# Altium schematic sheet io.SchDoc
size A
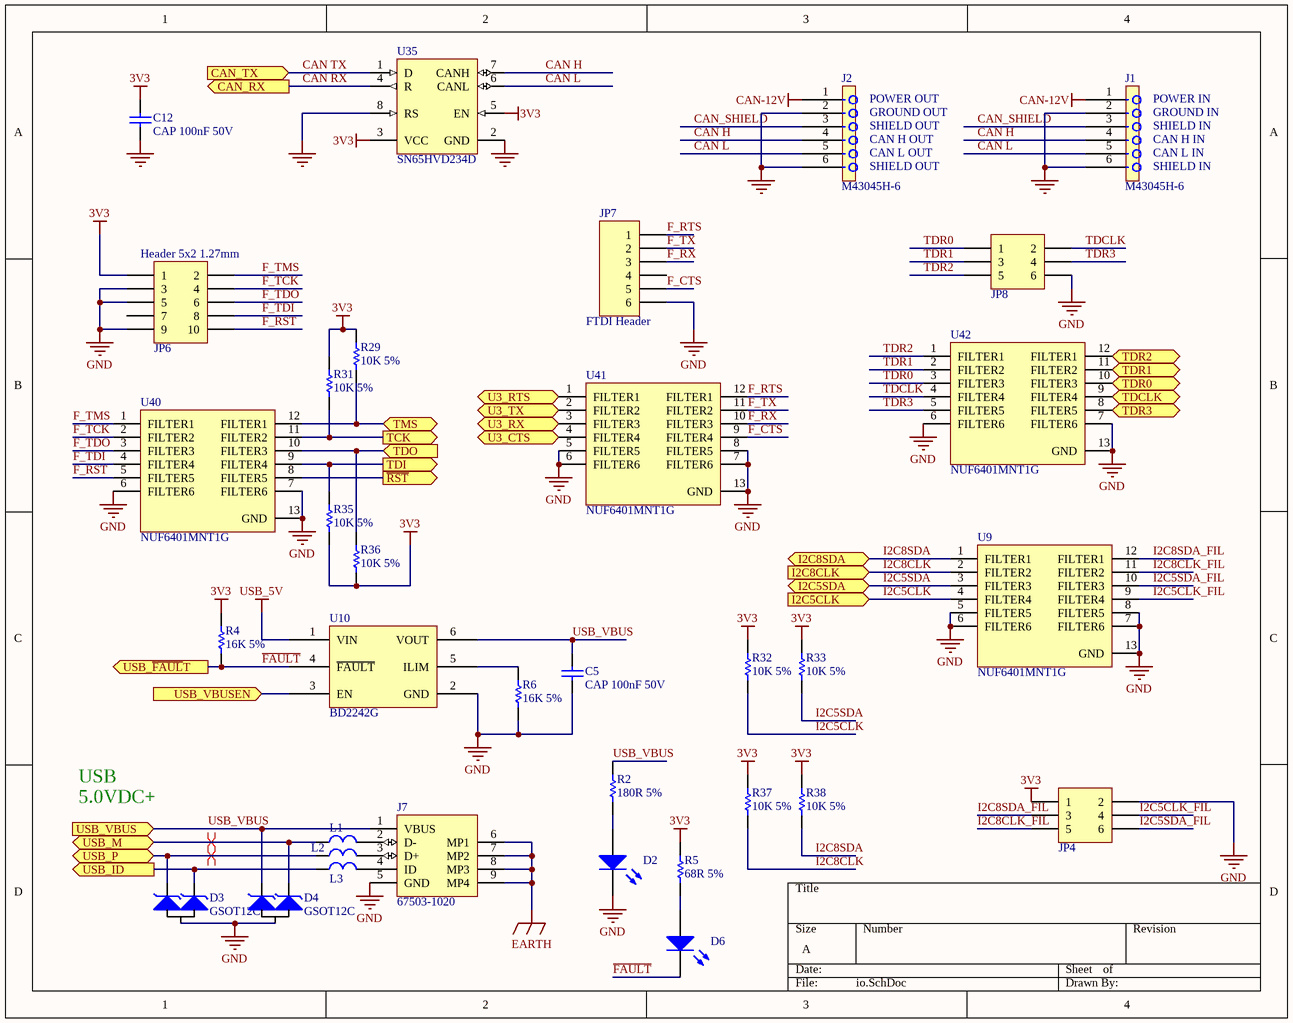
[diagram p0: io.SchDoc]

## Parts
C5  CAP 100nF 50V  [CAPC0603(1608)100_M]
C12  CAP 100nF 50V  [CAPC0603(1608)100_M]
D2  LED  [LED-0603]  (value not drawn)
D3  GSOT12C  [SOT-23 - ESD]
D4  GSOT12C  [SOT-23 - ESD]
D6  LED  [LED-0603]  (value not drawn)
J1  M43045H-6  [M43045H-6]
J2  M43045H-6  [M43045H-6]
J7  67503-1020  [MOLX-67503-1020_V]
JP4  Header 3x2 2.54mm  [2X3]  (value not drawn)
JP6  Header 5x2 1.27mm  [SOP10]
JP7  FTDI Header  [1X6]
JP8  Header 3x2 2.54mm  [2X3]  (value not drawn)
L1  MPZ1608S102A  [0603]  (value not drawn)
L2  MPZ1608S102A  [0603]  (value not drawn)
L3  MPZ1608S102A  [0603]  (value not drawn)
R2  180R 5%  [RESC0603(1608)_L]
R4  16K 5%  [RESC0603(1608)_L]
R5  68R 5%  [RESC0603(1608)_M]
R6  16K 5%  [RESC0603(1608)_L]
R29  10K 5%  [RESC0603(1608)_N]
R31  10K 5%  [RESC0603(1608)_N]
R32  10K 5%  [RESC0603(1608)_N]
R33  10K 5%  [RESC0603(1608)_N]
R35  10K 5%  [RESC0603(1608)_N]
R36  10K 5%  [RESC0603(1608)_N]
R37  10K 5%  [RESC0603(1608)_N]
R38  10K 5%  [RESC0603(1608)_N]
U9  NUF6401MNT1G  [ONSC-DFN-12-506AD-01_V]
U10  BD2242G  [SOT23-6]
U35  SN65HVD234D  [D8_M]
U40  NUF6401MNT1G  [ONSC-DFN-12-506AD-01_V]
U41  NUF6401MNT1G  [ONSC-DFN-12-506AD-01_V]
U42  NUF6401MNT1G  [ONSC-DFN-12-506AD-01_V]

## Ports
CAN_RX (out), CAN_TX (in), I2C5CLK (in), I2C5SDA (bidir), I2C8CLK (in), I2C8SDA (bidir), TCK (out), TDCLK (bidir), TDI (out), TDO (in), TDR0 (bidir), TDR1 (bidir), TDR2 (bidir), TDR3 (bidir), TMS (bidir), U3_CTS (in), U3_RTS (out), U3_RX (out), U3_TX (in), USB_ID (out), USB_M (bidir), USB_P (bidir), USB_VBUS (in), USB_VBUSEN (in), USB_~{FAUL}T (out), ~{RST} (out)

## Nets
3V3: C12.2 JP4.1 JP6.1 R4.2 R5.2 R29.2 R31.2 R32.2 R33.2 R35.1 R36.1 R37.2 R38.2 U35.3(VCC) U35.5(EN)
CAN-12V: J1.1 J2.1
EARTH: J7.6(MP1) J7.7(MP2) J7.8(MP3) J7.9(MP4)
GND: C5.1 C12.1 D2.2(K) D3.3(A) D4.3(A) J1.2 J1.6 J2.2 J2.6 J7.5(GND) JP4.2 JP6.3 JP6.5 JP6.9 JP7.6 JP8.6 R6.1 U9.5(FILTER5) U9.6(FILTER6) U9.7(FILTER6) U9.8(FILTER5) U9.13(GND) U10.2(GND) U35.2(GND) U35.8(RS) U40.6(FILTER6) U40.7(FILTER6) U40.13(GND) U41.5(FILTER5) U41.6(FILTER6) U41.7(FILTER6) U41.8(FILTER5) U41.13(GND) U42.6(FILTER6) U42.7(FILTER6) U42.13(GND)
USB_5V: U10.1(VIN)
CAN H: J1.4 J2.4 U35.7(CANH)
CAN L: J1.5 J2.5 U35.6(CANL)
CAN RX: U35.4(R) ; port CAN_RX
CAN TX: U35.1(D) ; port CAN_TX
CAN_SHIELD: J1.3 J2.3
~{FAULT}: D6.2(K) R4.1 U10.4(~{FAULT}) ; port USB_~{FAUL}T
F_CTS: JP7.5 U41.9(FILTER4)
F_~{RST}: JP6.10 U40.5(FILTER5)
F_RTS: JP7.1 U41.12(FILTER1)
F_RX: JP7.3 U41.10(FILTER3)
F_TCK: JP6.4 U40.2(FILTER2)
F_TDI: JP6.8 U40.4(FILTER4)
F_TDO: JP6.6 U40.3(FILTER3)
F_TMS: JP6.2 U40.1(FILTER1)
F_TX: JP7.2 U41.11(FILTER2)
I2C5CLK: R32.1 U9.4(FILTER4) ; port I2C5CLK
I2C5CLK_FIL: JP4.4 U9.9(FILTER4)
I2C5SDA: R33.1 U9.3(FILTER3) ; port I2C5SDA
I2C5SDA_FIL: JP4.6 U9.10(FILTER3)
I2C8CLK: R37.1 U9.2(FILTER2) ; port I2C8CLK
I2C8CLK_FIL: JP4.5 U9.11(FILTER2)
I2C8SDA: R38.1 U9.1(FILTER1) ; port I2C8SDA
I2C8SDA_FIL: JP4.3 U9.12(FILTER1)
~{RST}: U40.8(FILTER5) ; port ~{RST}
TCK: R31.1 U40.11(FILTER2) ; port TCK
TDCLK: JP8.2 U42.4(FILTER4)
TDCLK: U42.9(FILTER4) ; port TDCLK  [a separate net that carries the same name]
TDI: R35.2 U40.9(FILTER4) ; port TDI
TDO: R36.2 U40.10(FILTER3) ; port TDO
TDR0: JP8.1 U42.3(FILTER3)
TDR0: U42.10(FILTER3) ; port TDR0  [a separate net that carries the same name]
TDR1: JP8.3 U42.2(FILTER2)
TDR1: U42.11(FILTER2) ; port TDR1  [a separate net that carries the same name]
TDR2: JP8.5 U42.1(FILTER1)
TDR2: U42.12(FILTER1) ; port TDR2  [a separate net that carries the same name]
TDR3: JP8.4 U42.5(FILTER5)
TDR3: U42.8(FILTER5) ; port TDR3  [a separate net that carries the same name]
TMS: R29.1 U40.12(FILTER1) ; port TMS
U3_CTS: U41.4(FILTER4) ; port U3_CTS
U3_RTS: U41.1(FILTER1) ; port U3_RTS
U3_RX: U41.3(FILTER3) ; port U3_RX
U3_TX: U41.2(FILTER2) ; port U3_TX
USB_ID: D3.2(K2) L3.1 ; port USB_ID
USB_M: D4.2(K2) L1.1 ; port USB_M
USB_P: D3.1(K1) L2.1 ; port USB_P
USB_VBUS: C5.2 D4.1(K1) J7.1(VBUS) R2.2 U10.6(VOUT) ; port USB_VBUS
USB_VBUSEN: U10.3(EN) ; port USB_VBUSEN
NetD2_1: D2.1(A) R2.1
NetD6_1: D6.1(A) R5.1
NetJ7_2: J7.2(D-) L1.2
NetJ7_3: J7.3(D+) L2.2
NetJ7_4: J7.4(ID) L3.2
NetR6_2: R6.2 U10.5(ILIM)

Not connected (* = marked no-connect by the designer): JP6 7; JP7 4

## Layout directives
differential pair: USB_M, USB_P

## Notes on the sheet
- (near J2) POWER OUT
- (near J1) POWER IN
- (near J2) GROUND OUT
- (near J2) SHIELD OUT
- (near J2) CAN H OUT
- (near J2) CAN L OUT
- (near J1) GROUND IN
- (near J1) SHIELD IN
- (near J1) CAN H IN
- (near J1) CAN L IN
- USB
- 5.0VDC+

## Library data of the parts
C5 C12 = CMP-1035-00010-1: CAP 100nF 50V Â±0.1pF 0603 (1608 Metric) Thickness 1mm SMD; Case-Metric: 1608; Case-EIA: 0603; Tolerance: Â±0.1pF; Technology: SMT; Value: 100nF; Max Thickness: 1 mm; Rated Voltage: 50 V
D2 D6 = LED: Typical RED, GREEN, YELLOW, AMBER GaAs LED; Published: 8-Jun-2000; LatestRevisionDate: 17-Jul-2002; LatestRevisionNote: Re-released for DXP Platform.; PackageVersion: Feb-2002; PackageReference: 3.2X1.6X1.1; Publisher: Altium Limited; PackageDescription: SM LED; 2 Flat Leads; Supplier 1: Digi-Key; Supplier 2: Mouser; Supplier Part Number 1: 475-1409-1-ND; Supplier Part Number 2: 720-LGQ971-KN-1
D3 D4 = 2749: DIO GSOT12C ESD 2LINE 12V SOT23; MPN: GSOT12C-E3-08; COST1K: 0.11250; COST10: 0.3750; COST100: 0.25000; MAN: Vishay Semiconductor Diodes Division; SPN: GSOT12C-E3-08DKR-ND; Supplier: Digi-Key
J1 J2 = CON6: CID: 317
J7 = CMP-0411-00002-1: USB, MINI, SMD, RA KME04-USBMU03A01; Manufacturer: Molex; ComponentLink1URL: http://www.molex.com/; PartNumber: 67503-1020; Mounting Technology: Surface Mount; ComponentLink1Description: Manufacturer URL; Terminal Pitch: 0.8 mm; DatasheetVersion: Rev F, 06/2009; ComponentLink2Description: Datasheet; PackageDescription: Mini USB Connector, SMT, Righer Angle; ComponentLink2URL: http://www.molex.com/pdm_docs/sd/675031020_sd.pdf; PackageReference: 67503-1020
JP4 JP8 = Header 3x2: Header, 6-Pin; Supplier 1: Digi-Key; Supplier 2: Mouser; Supplier Part Number 1: 952-1788-ND; Supplier Part Number 2: 855-M20-9980446
JP6 = Header 5x2: Program; Supplier 1: Digi-Key; Supplier Part Number 1: 1175-1735-ND
JP7 = Header 6: Header, 6-Pin; Supplier 1: Digi-Key; Supplier 2: Mouser; Supplier Part Number 1: 952-2270-ND; Supplier Part Number 2: 538-90120-1086
L1-L3 = 2982: IND FERRITE CHIP BEAD 1000 OHM @ 100MHz 800mA 0603; COST1K: 0.02717; COST10: 0.0790; COST100: 0.04720; MAN: TDK Corporation; SPN: 445-8694-6-ND; MPN: MPZ1608S102A; Supplier: Digi-Key
R2 = CMP-1012-00056-1: 180R 0.1W 5% 0603 (1608 Metric)  SMD; Value: 180.00 Ohm; Case-EIA: 0603; Case-Metric: 1608; Power: 0.1 W; Technology: SMT; Tolerance: 5 %
R4 R6 = CMP-1012-00103-1: 16K 0.1W 5% 0603 (1608 Metric)  SMD; Value: 16000.00 Ohm; Case-EIA: 0603; Case-Metric: 1608; Tolerance: 5 %; Technology: SMT; Power: 0.1 W
R5 = CMP-1012-00046-1: 68R 0.1W 5% 0603 (1608 Metric)  SMD; Case-EIA: 0603; Value: 68.00 Ohm; Case-Metric: 1608; Power: 0.1 W; Technology: SMT; Tolerance: 5 %
R29 R31-R33 R35-R38 = CMP-1012-00098-1: 10K 0.1W 5% 0603 (1608 Metric)  SMD; Case-EIA: 0603; Value: 10000.00 Ohm; Case-Metric: 1608; Technology: SMT; Tolerance: 5 %; Power: 0.1 W
U9 U40-U42 = CMP-1066-00005-1: 6-Channel EMI Filter with Integrated ESD Protection, -40 to 105 degC, 12-Pin DFN, Pb-Free, Tape and Reel; Manufacturer: On Semiconductor; Number of Lines: 6; VRWM Max (V): 5; V(BR) Typ (V): 7; PackageReference: DFN-12-506AD-01; PartNumber: NUF6401MNT1G; ComponentLink3Description: Package Specification; RoHS: Pb-Free; Mounting Technology: Surface Mount; ComponentLink2Description: Datasheet; ComponentLink1Description: Manufacturer URL; PackageDescription: 12-Pin Small Outline No-Lead, Body 3 x 1.35 mm, Pitch 0.5 mm; Packing: Tape and Reel; DatasheetVersion: Rev. 2; ComponentLink2URL: http://www.onsemi.com/pub_link/Collateral/NUF6401-D.PDF; PackageVersion: Rev. J, 07/2008; ComponentLink3URL: http://www.onsemi.com/pub_link/Collateral/506AD.PDF; ComponentLink1URL: http://www.onsemi.com/
  U40-U42: Supplier 1: Digi-Key; Supplier Part Number 1: NUF6401MNT1GOSCT-ND
U10 = RT9728A: BD2242G-GTR; Supplier 1: Digi-Key; Supplier Part Number 1: BD2242G-GCT-ND
U35 = CMP-0315-00083-1: 3.3V CAN Transceiver with Sleep Mode, 6 mA, -40 to 125 degC, 8-pin SOIC (D), Green (RoHS & no Sb/Br); Manufacturer: Texas Instruments; Receivers Per Package: 1; ICC(Max)(mA): 6; Bus Fault Voltage(V): +/-30; Supply Voltage(s)(V): 3.3; Rating: Catalog; Transient Pulse Protection(V): -100 to 100; PartNumber: SN65HVD234D; SubFamily: CAN; DatasheetVersion: SLLS557F; Mounting Technology: Surface Mount; Eco-Plan: Green (RoHS & no Sb/Br); PackageVersion: revM, Jun-2011; PackageReference: D8; ComponentLink1Description: Datasheet; Drivers Per Package: 1; Isolated: No; ComponentLink1URL: http://www.ti.com/general/docs/lit/getliterature.tsp?genericPartNumber=SN65HVD234&fileType=pdf; PackageDescription: 8-Pin Plastic Small Outline Integrated Circuit, 4.9 x 3.9 mm, Pitch 1.27 mm Pitch; Code_JEDEC: MS-012AA; Low Power Mode: Sleep; Footprint: PCA82C250, excludes pin5